# EAGLE design raspberry-alarm-clock-v2 (EAGLE 5.12)

## Sheet 1 of 7
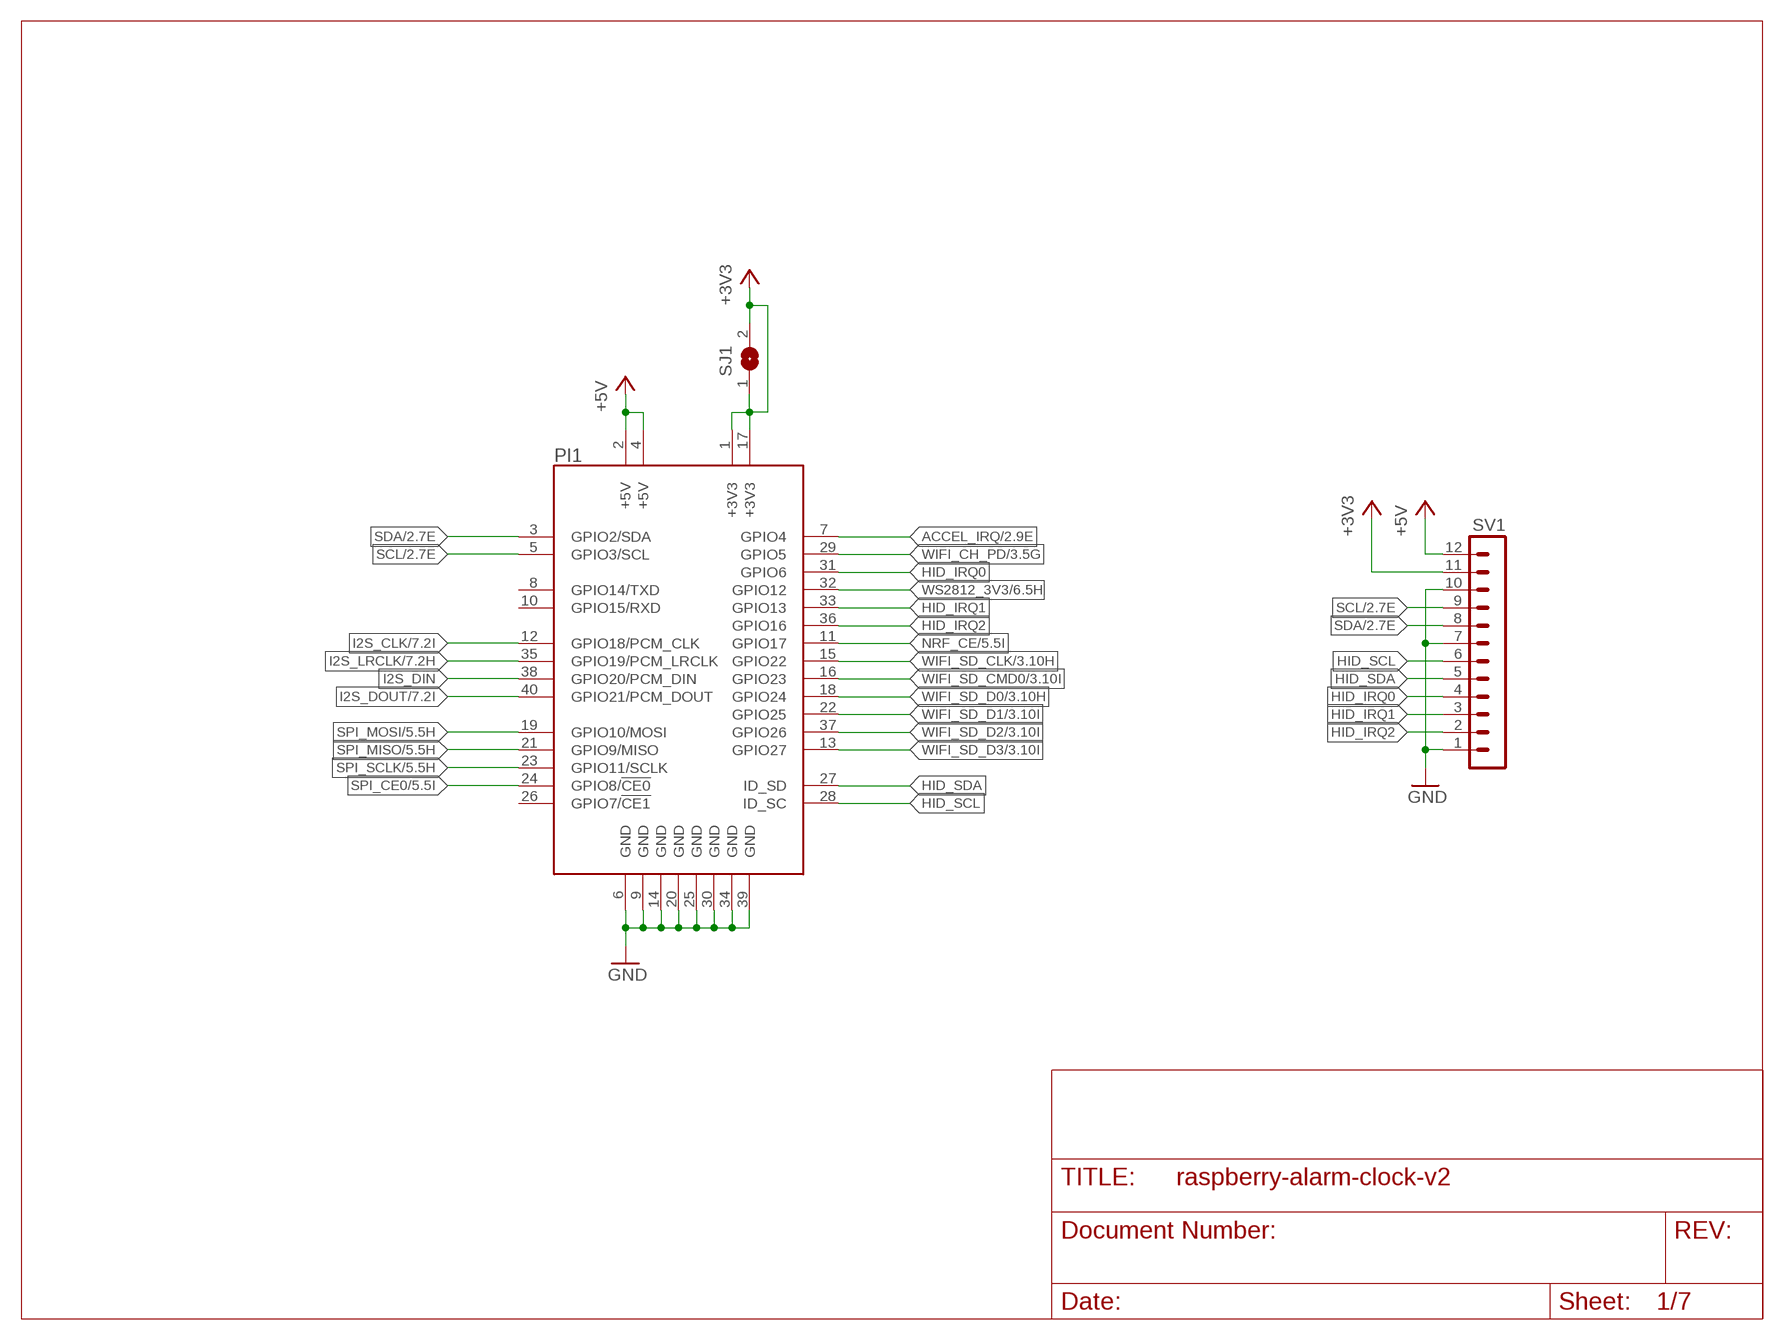
[diagram p0: schematic, sheet 1]

### Parts
PI1  PIHAT-REVERSE-COMBO  [PIHAT-REVERSE-COMBO]
SJ1  SJ  [SJ]
SV1  MA12-1W  [MA12-1W]

### Nets
+3V3: PI1.1(+3V3) PI1.17(+3V3) SJ1.1 SJ1.2 SV1.11 ; also sheet 2,3,4,5
+5V: PI1.2(+5V) PI1.4(+5V) SV1.12 ; also sheet 4,6
ACCEL_IRQ: PI1.7(GPIO4) ; also sheet 2
GND: PI1.6(GND) PI1.9(GND) PI1.14(GND) PI1.20(GND) PI1.25(GND) PI1.30(GND) PI1.34(GND) PI1.39(GND) SV1.1 SV1.7 SV1.10 ; also sheet 2,3,4,5,6,7
HID_IRQ0: PI1.31(GPIO6) SV1.4
HID_IRQ1: PI1.33(GPIO13) SV1.3
HID_IRQ2: PI1.36(GPIO16) SV1.2
HID_SCL: PI1.28(ID_SC) SV1.6
HID_SDA: PI1.27(ID_SD) SV1.5
I2S_CLK: PI1.12(GPIO18/PCM_CLK) ; also sheet 7
I2S_DIN: PI1.38(GPIO20/PCM_DIN)
I2S_DOUT: PI1.40(GPIO21/PCM_DOUT) ; also sheet 7
I2S_LRCLK: PI1.35(GPIO19/PCM_LRCLK) ; also sheet 7
NRF_CE: PI1.11(GPIO17) ; also sheet 5
SCL: PI1.5(GPIO3/SCL) SV1.9 ; also sheet 2
SDA: PI1.3(GPIO2/SDA) SV1.8 ; also sheet 2
SPI_CE0: PI1.24(GPIO8/!CE0) ; also sheet 5
SPI_MISO: PI1.21(GPIO9/MISO) ; also sheet 5
SPI_MOSI: PI1.19(GPIO10/MOSI) ; also sheet 5
SPI_SCLK: PI1.23(GPIO11/SCLK) ; also sheet 5
WIFI_CH_PD: PI1.29(GPIO5) ; also sheet 3
WIFI_SD_CLK: PI1.15(GPIO22) ; also sheet 3
WIFI_SD_CMD0: PI1.16(GPIO23) ; also sheet 3
WIFI_SD_D0: PI1.18(GPIO24) ; also sheet 3
WIFI_SD_D1: PI1.22(GPIO25) ; also sheet 3
WIFI_SD_D2: PI1.37(GPIO26) ; also sheet 3
WIFI_SD_D3: PI1.13(GPIO27) ; also sheet 3
WS2812_3V3: PI1.32(GPIO12) ; also sheet 6
Unconnected: PI1.8(GPIO14/TXD) PI1.10(GPIO15/RXD) PI1.26(GPIO7/!CE1)

## Sheet 2 of 7
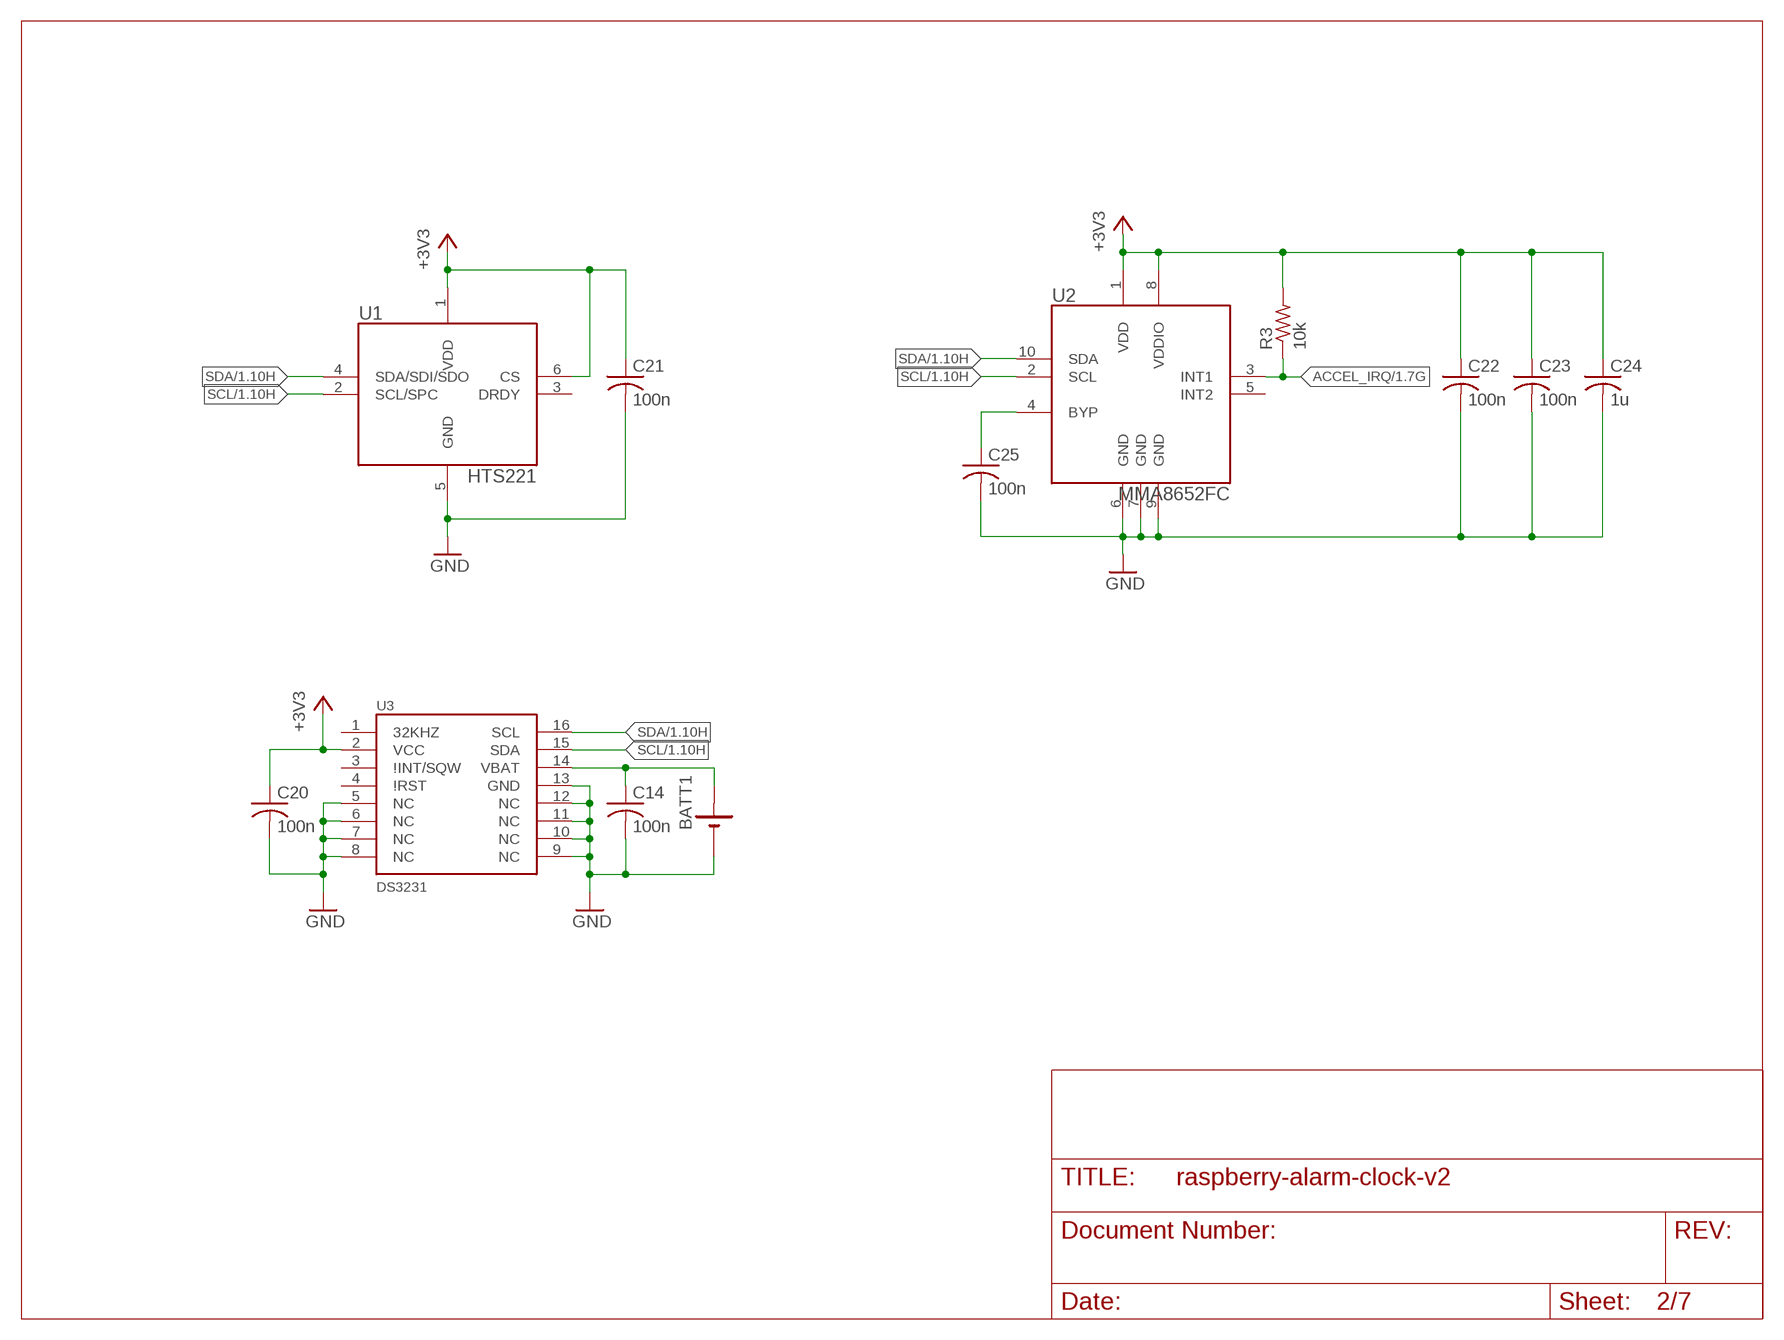
[diagram p1: schematic, sheet 2]

### Parts
BATT1  2032SMD  [2032SMD]
C14  100n  C-USC0603  [C0603]
C20  100n  C-USC0603  [C0603]
C21  100n  C-USC0603  [C0603]
C22  100n  C-USC0603  [C0603]
C23  100n  C-USC0603  [C0603]
C24  1u  C-USC0603  [C0603]
C25  100n  C-USC0603  [C0603]
R3  10k  R-US_R0603  [R0603]
U1  HTS221  [HLGA-6L]
U2  MMA8652FC  [DFN-10]
U3  DS3231  [SO16W]

### Nets
+3V3: C20.1 C21.1 C22.1 C23.1 C24.1 R3.2 U1.1(VDD) U1.6(CS) U2.1(VDD) U2.8(VDDIO) U3.2(VCC) ; also sheet 1,3,4,5
ACCEL_IRQ: R3.1 U2.3(INT1) ; also sheet 1
GND: BATT1.- C14.2 C20.2 C21.2 C22.2 C23.2 C24.2 C25.2 U1.5(GND) U2.6(GND) U2.7(GND) U2.9(GND) U3.5(NC) U3.6(NC) U3.7(NC) U3.8(NC) U3.9(NC) U3.10(NC) U3.11(NC) U3.12(NC) U3.13(GND) ; also sheet 1,3,4,5,6,7
N$16: BATT1.+ C14.1 U3.14(VBAT)
N$17: C25.1 U2.4(BYP)
SCL: U1.2(SCL/SPC) U2.2(SCL) U3.15(SDA) ; also sheet 1
SDA: U1.4(SDA/SDI/SDO) U2.10(SDA) U3.16(SCL) ; also sheet 1
Unconnected: U1.3(DRDY) U2.5(INT2) U3.1(32KHZ) U3.3(\!INT/SQW) U3.4(\!RST)

## Sheet 3 of 7
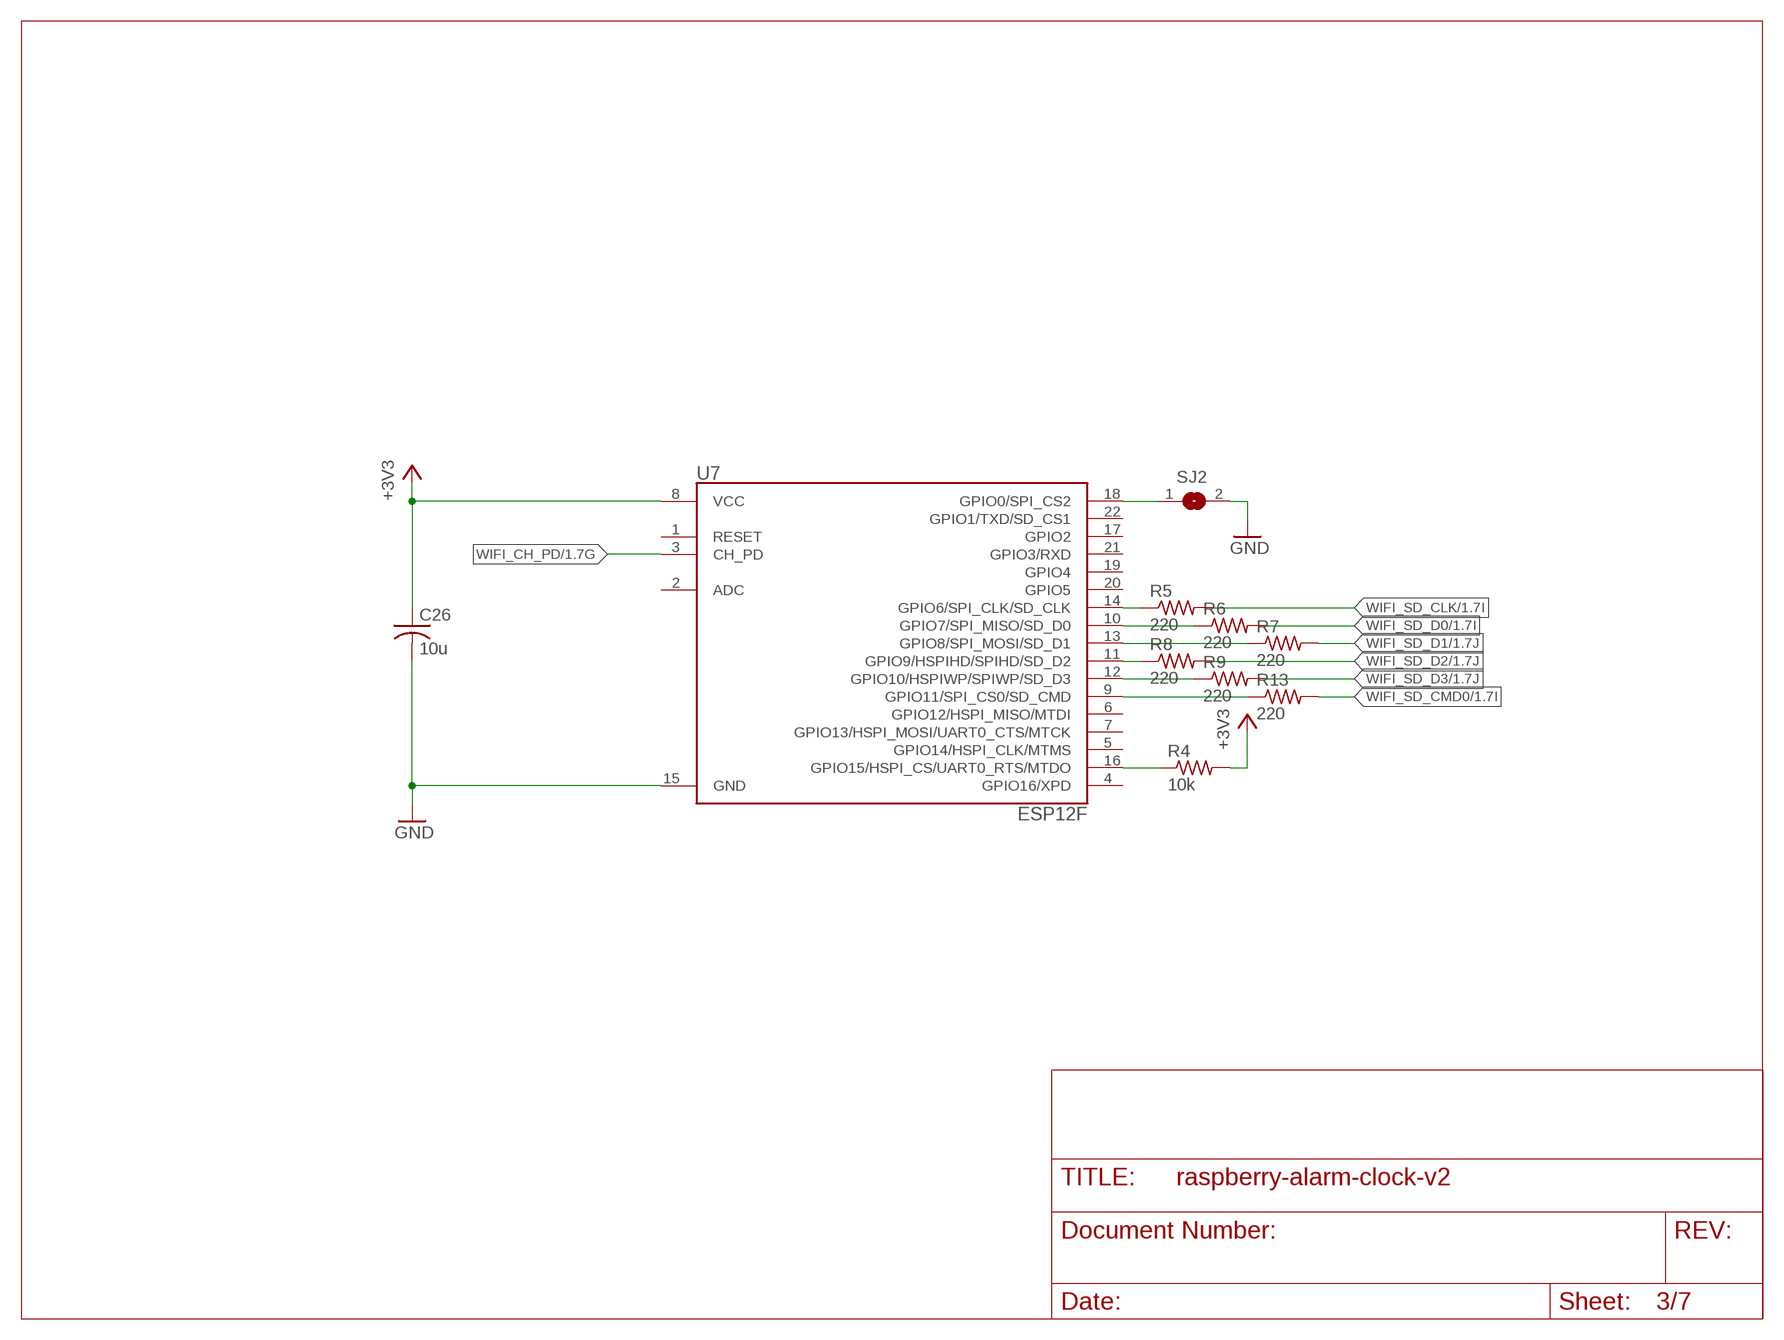
[diagram p2: schematic, sheet 3]

### Parts
C26  10u  C-USC0805  [C0805]
R4  10k  R-US_R0603  [R0603]
R5  220  R-US_R0603  [R0603]
R6  220  R-US_R0603  [R0603]
R7  220  R-US_R0603  [R0603]
R8  220  R-US_R0603  [R0603]
R9  220  R-US_R0603  [R0603]
R13  220  R-US_R0603  [R0603]
SJ2  SJ  [SJ]
U7  ESP12F  [ESP12F]

### Nets
+3V3: C26.1 R4.2 U7.8(VCC) ; also sheet 1,2,4,5
GND: C26.2 SJ2.2 U7.15(GND) ; also sheet 1,2,4,5,6,7
N$18: R6.1 U7.10(GPIO7/SPI_MISO/SD_D0)
N$19: R7.1 U7.13(GPIO8/SPI_MOSI/SD_D1)
N$20: R5.1 U7.14(GPIO6/SPI_CLK/SD_CLK)
N$21: R8.1 U7.11(GPIO9/HSPIHD/SPIHD/SD_D2)
N$22: R9.1 U7.12(GPIO10/HSPIWP/SPIWP/SD_D3)
N$23: R13.1 U7.9(GPIO11/SPI_CS0/SD_CMD)
N$24: R4.1 U7.16(GPIO15/HSPI_CS/UART0_RTS/MTDO)
N$25: SJ2.1 U7.18(GPIO0/SPI_CS2)
WIFI_CH_PD: U7.3(CH_PD) ; also sheet 1
WIFI_SD_CLK: R5.2 ; also sheet 1
WIFI_SD_CMD0: R13.2 ; also sheet 1
WIFI_SD_D0: R6.2 ; also sheet 1
WIFI_SD_D1: R7.2 ; also sheet 1
WIFI_SD_D2: R8.2 ; also sheet 1
WIFI_SD_D3: R9.2 ; also sheet 1
Unconnected: U7.1(RESET) U7.2(ADC) U7.4(GPIO16/XPD) U7.5(GPIO14/HSPI_CLK/MTMS) U7.6(GPIO12/HSPI_MISO/MTDI) U7.7(GPIO13/HSPI_MOSI/UART0_CTS/MTCK) U7.17(GPIO2) U7.19(GPIO4) U7.20(GPIO5) U7.21(GPIO3/RXD) U7.22(GPIO1/TXD/SD_CS1)

## Sheet 4 of 7
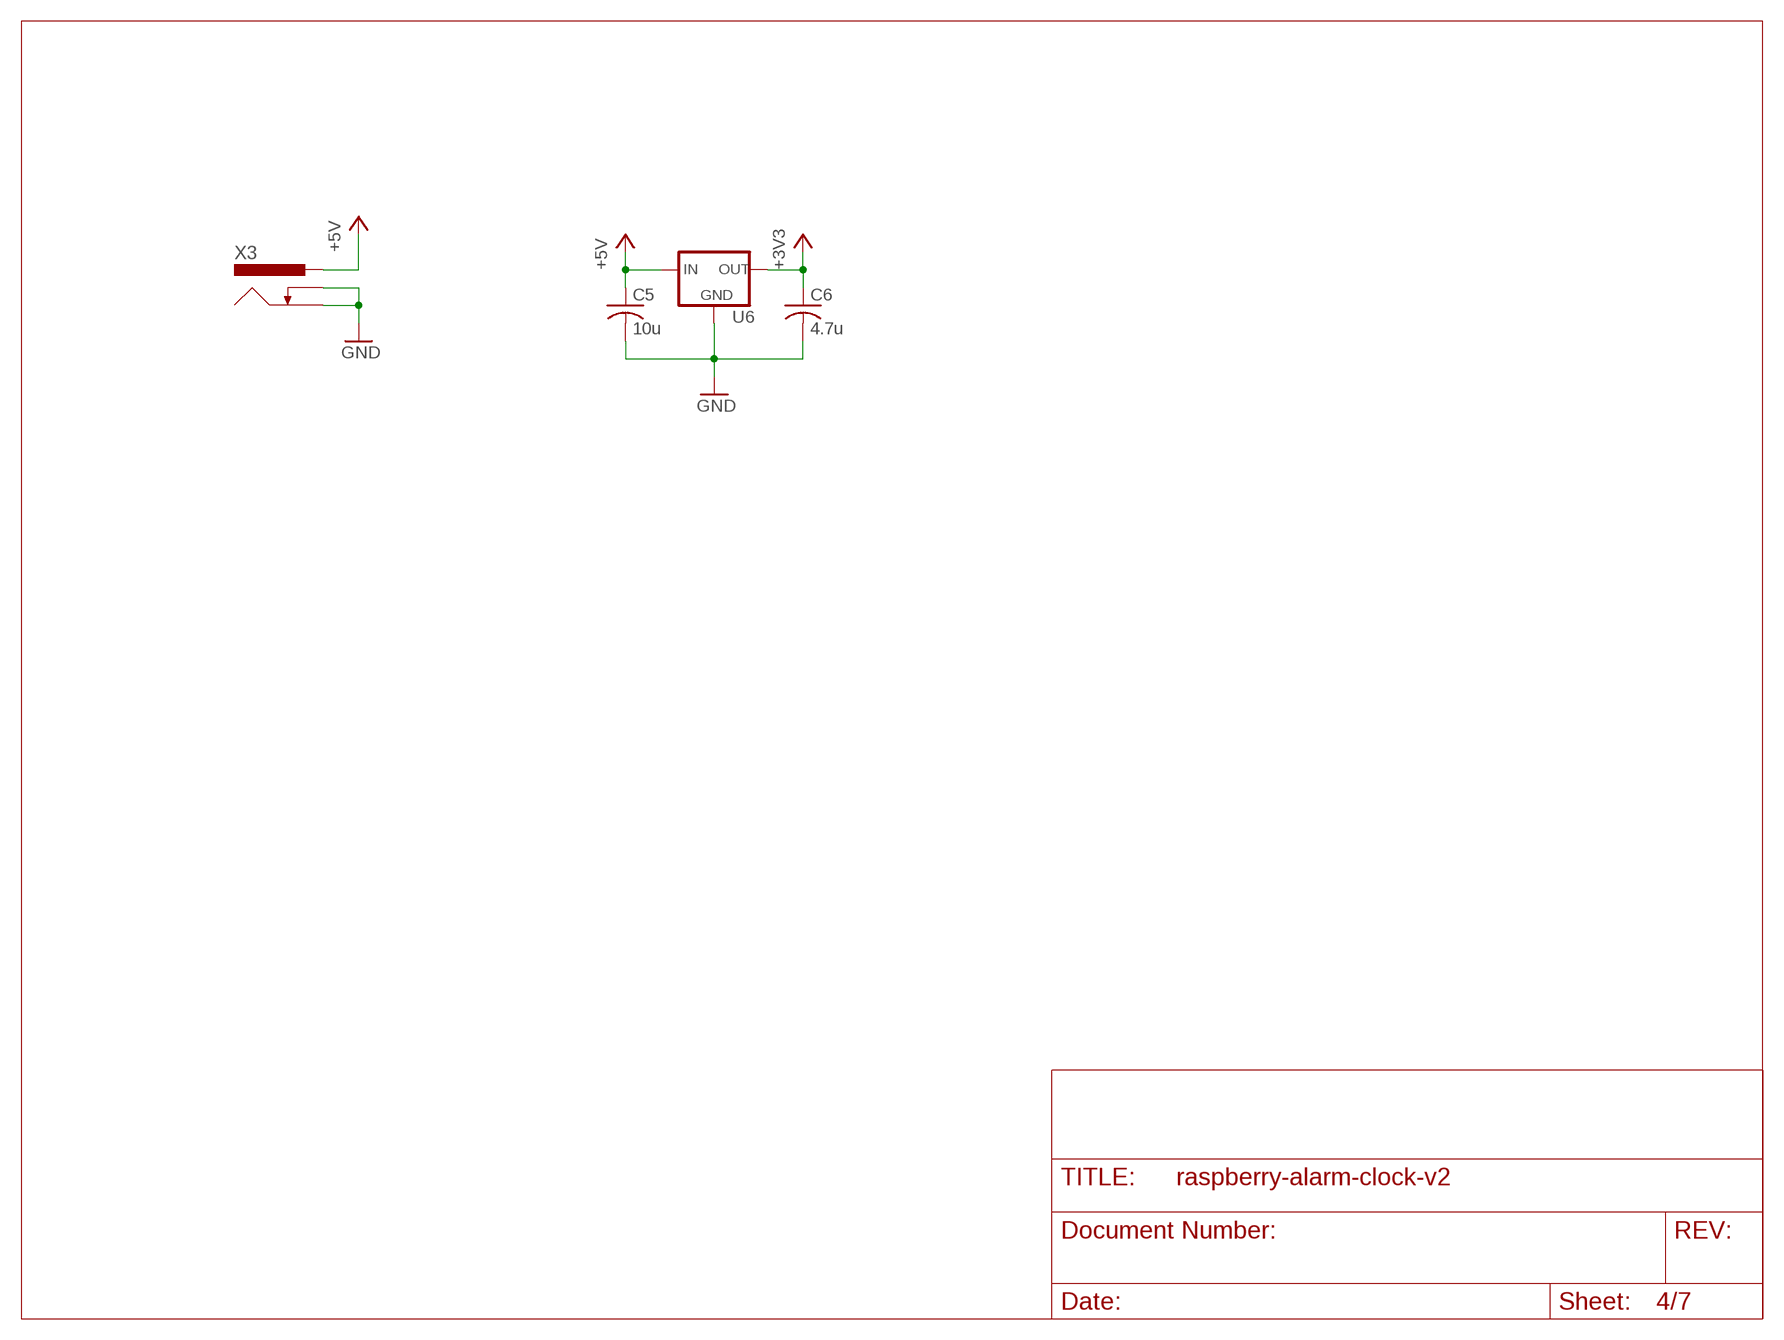
[diagram p3: schematic, sheet 4]

### Parts
C5  10u  C-USC0805  [C0805]
C6  4.7u  C-USC0805  [C0805]
U6  LM1117  [SOT223]
X3  PJ-002-SMTBH  [PJ-002-SMT]

### Nets
+3V3: C6.1 U6.2(OUT) ; also sheet 1,2,3,5
+5V: C5.1 U6.3(IN) X3.1A ; also sheet 1,6
GND: C5.2 C6.2 U6.1(GND) X3.2 X3.3 ; also sheet 1,2,3,5,6,7

## Sheet 5 of 7
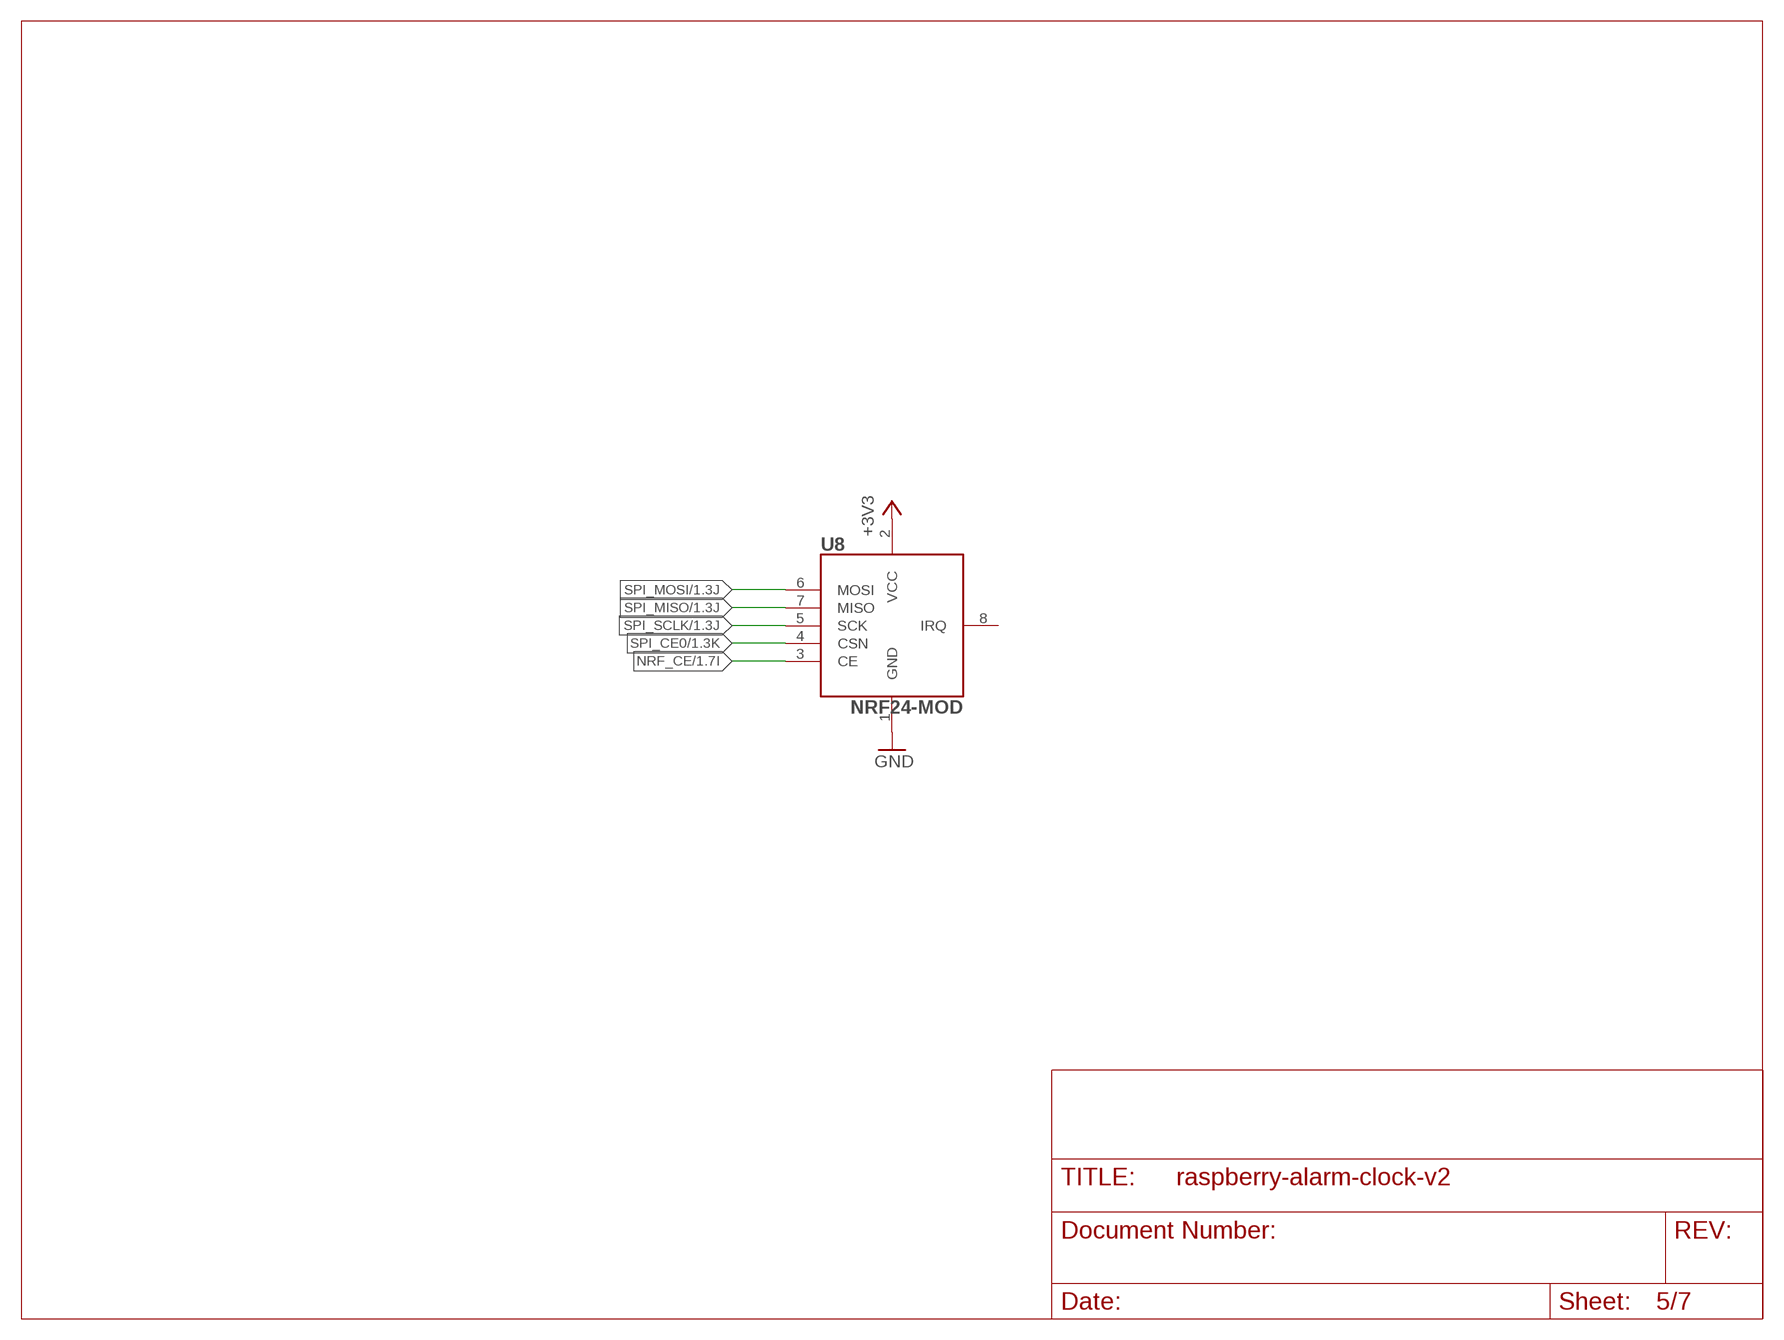
[diagram p4: schematic, sheet 5]

### Parts
U8  NRF24-MOD  [NRF24]

### Nets
+3V3: U8.2(VCC) ; also sheet 1,2,3,4
GND: U8.1(GND) ; also sheet 1,2,3,4,6,7
NRF_CE: U8.3(CE) ; also sheet 1
SPI_CE0: U8.4(CSN) ; also sheet 1
SPI_MISO: U8.7(MISO) ; also sheet 1
SPI_MOSI: U8.6(MOSI) ; also sheet 1
SPI_SCLK: U8.5(SCK) ; also sheet 1
Unconnected: U8.8(IRQ)

## Sheet 6 of 7
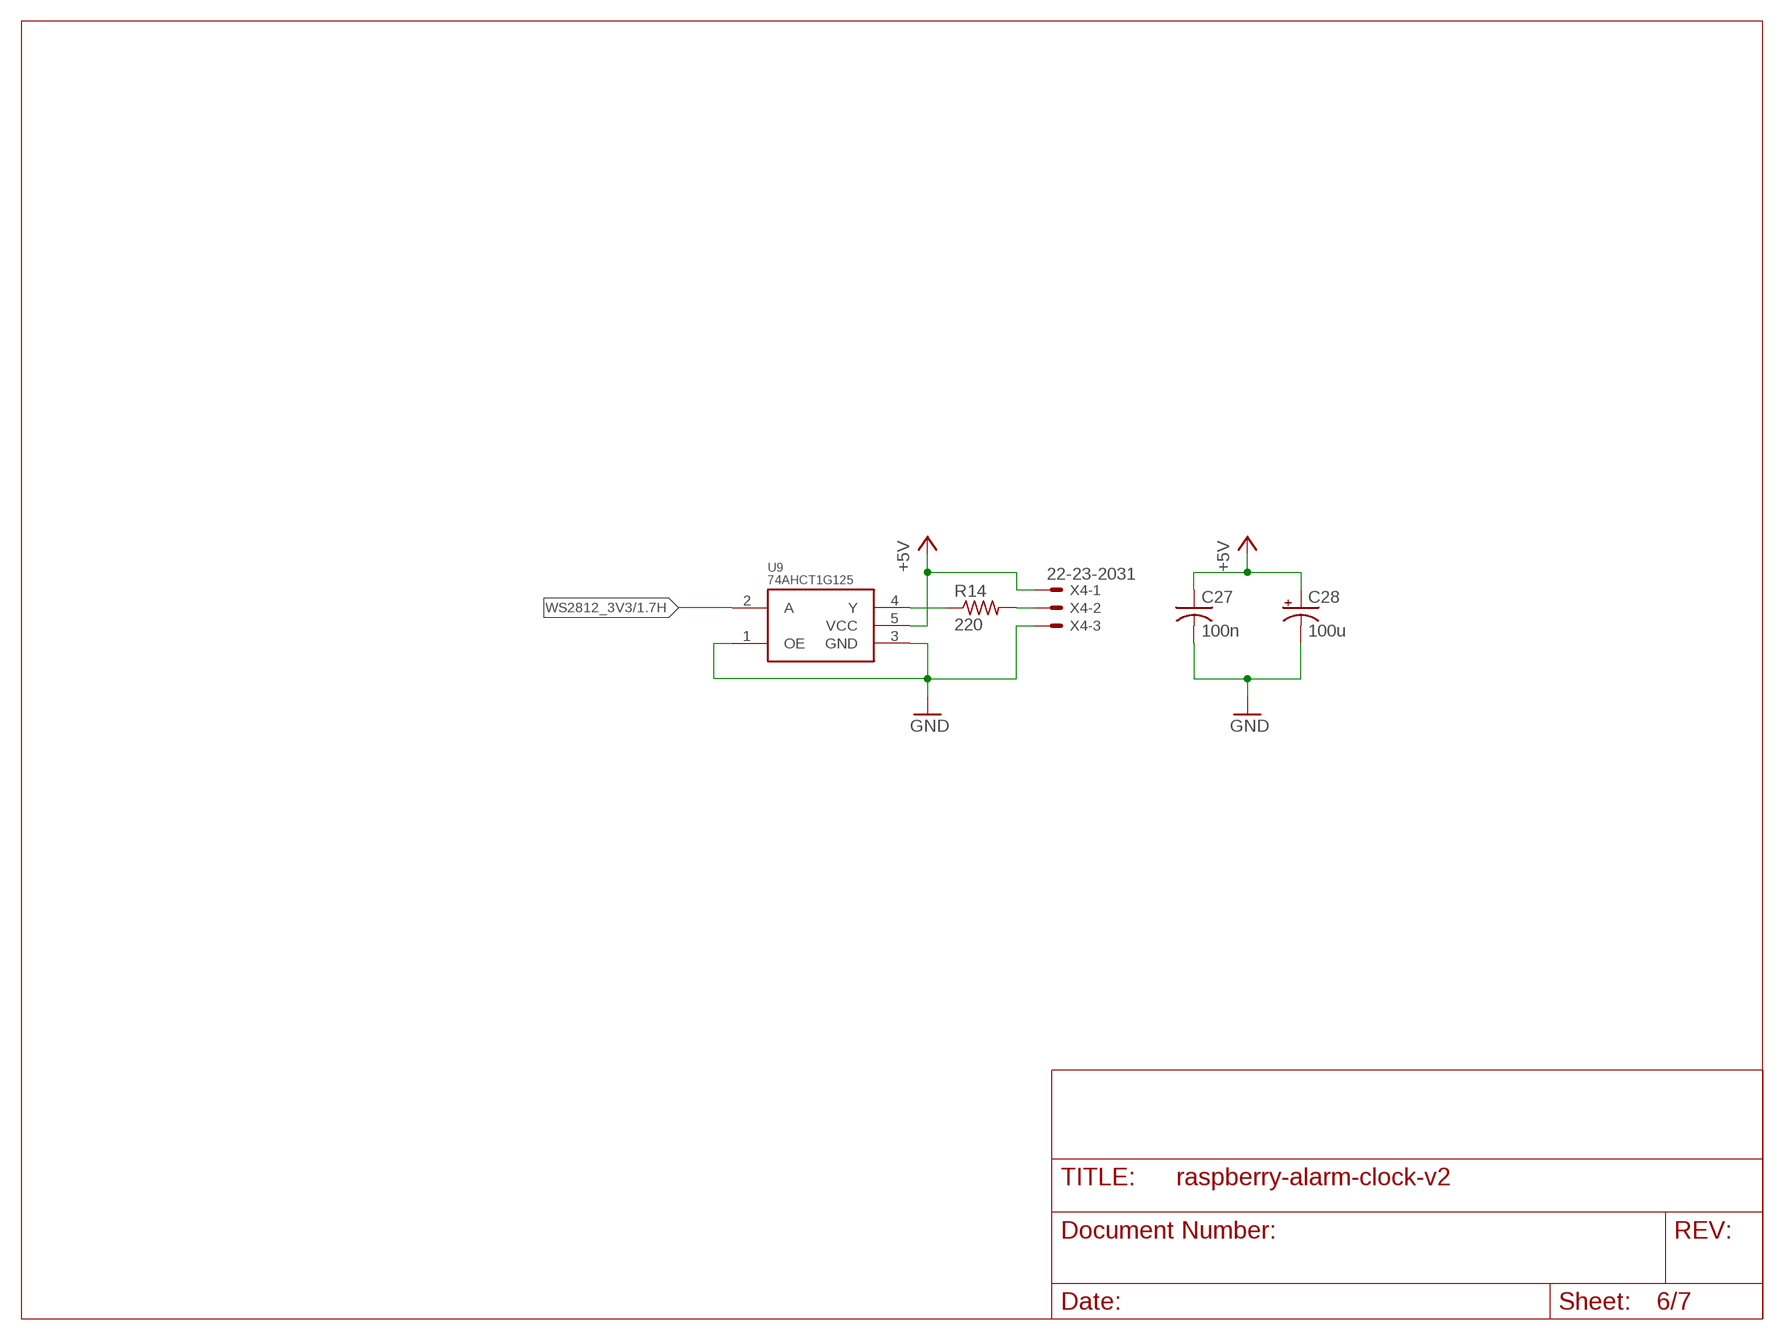
[diagram p5: schematic, sheet 6]

### Parts
C27  100n  C-USC0603  [C0603]
C28  100u  CPOL-USC  [PANASONIC_C]
R14  220  R-US_R0603  [R0603]
U9  74AHCT1G125  74LVC1G125  [SOT-23-5]
X4  22-23-2031  [22-23-2031]

### Nets
+5V: C27.1 C28.+ U9.5(VCC) X4.1 ; also sheet 1,4
GND: C27.2 C28.- U9.1(OE) U9.3(GND) X4.3 ; also sheet 1,2,3,4,5,7
N$26: R14.1 U9.4(Y)
N$27: R14.2 X4.2
WS2812_3V3: U9.2(A) ; also sheet 1

## Sheet 7 of 7
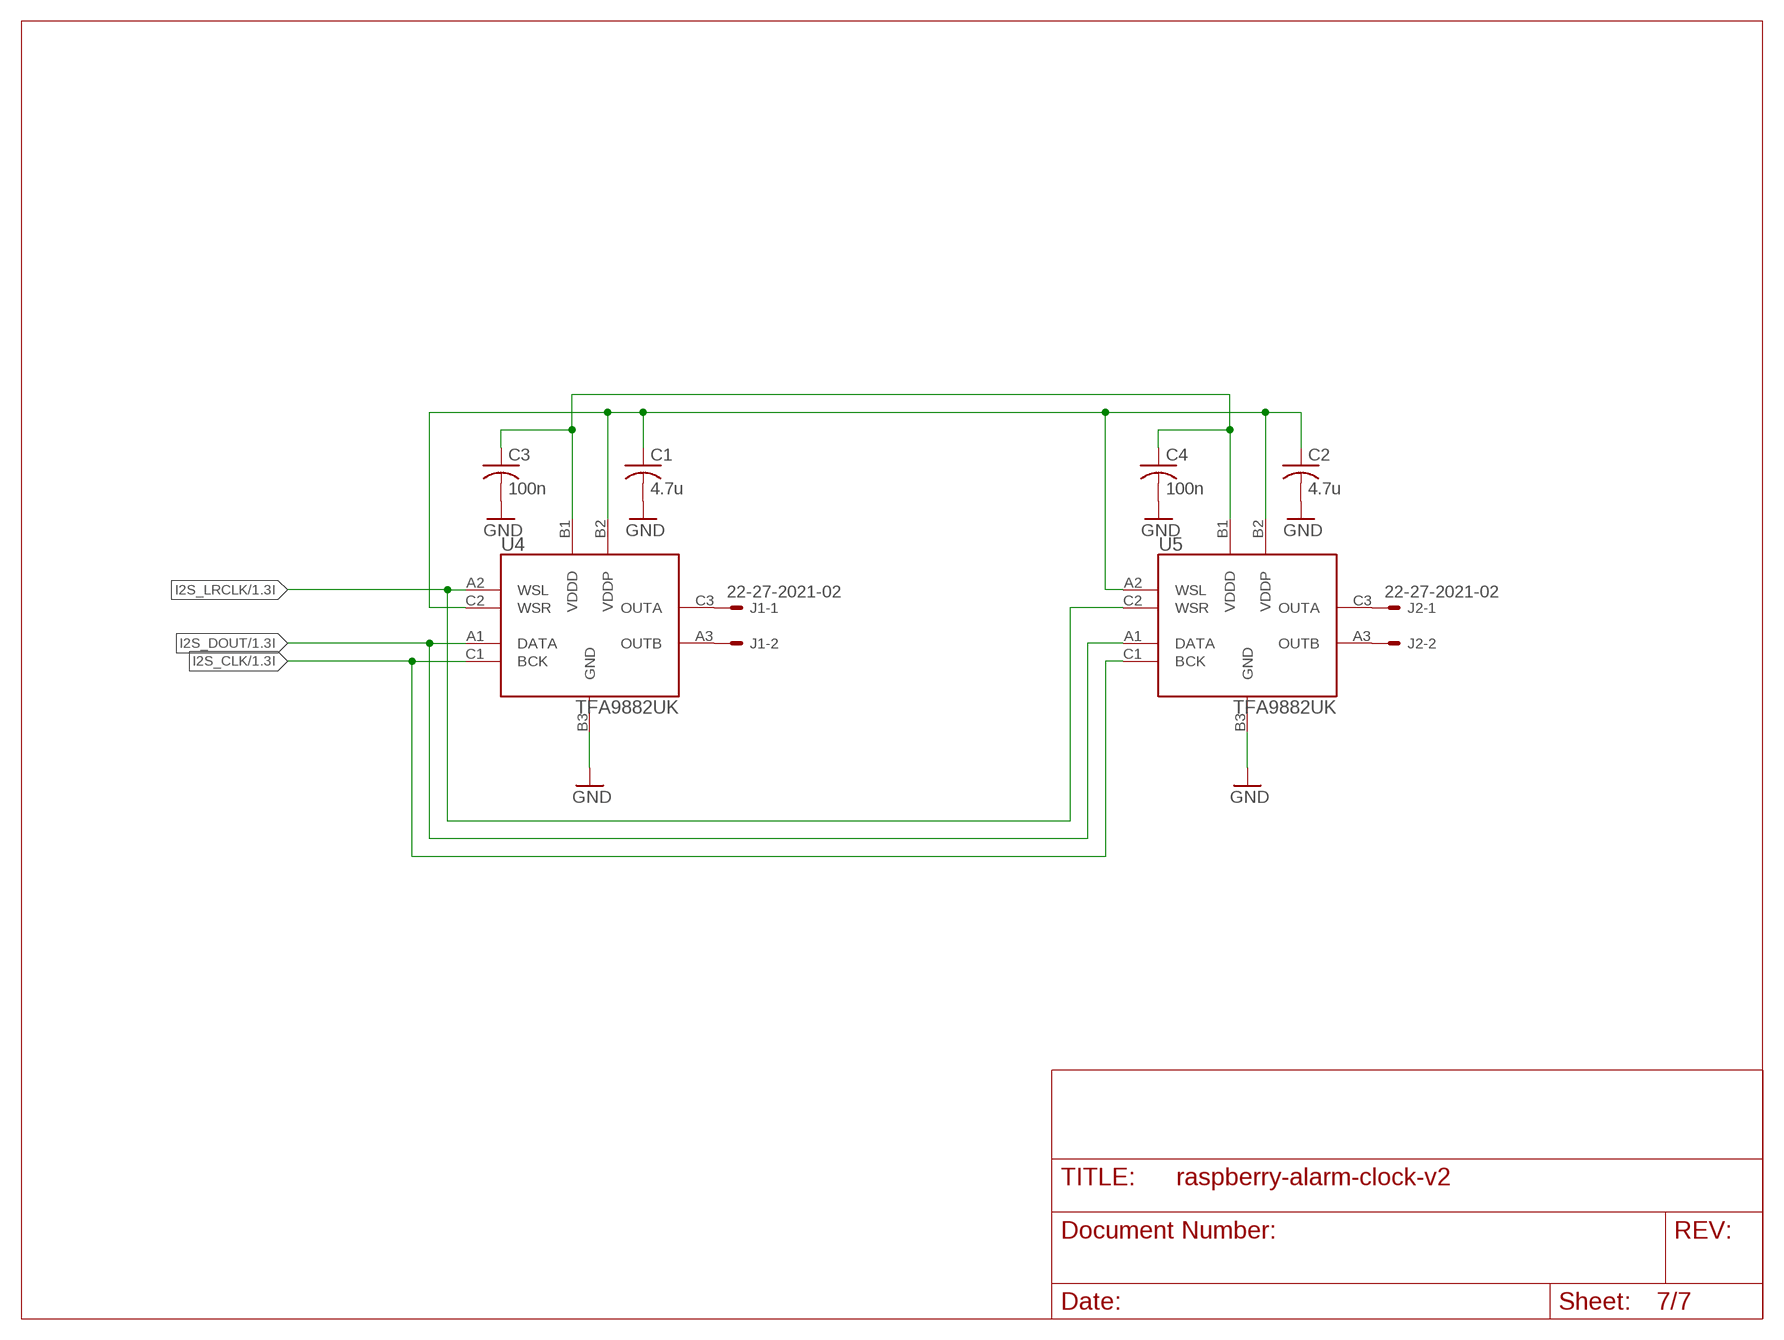
[diagram p6: schematic, sheet 7]

### Parts
C1  4.7u  C-USC0805  [C0805]
C2  4.7u  C-USC0805  [C0805]
C3  100n  C-USC0603  [C0603]
C4  100n  C-USC0603  [C0603]
J1  22-27-2021-02  [6410-02]
J2  22-27-2021-02  [6410-02]
U4  TFA9882UK  [WLCSP9]
U5  TFA9882UK  [WLCSP9]

### Nets
GND: C1.2 C2.2 C3.2 C4.2 U4.B3(GND) U5.B3(GND) ; also sheet 1,2,3,4,5,6
I2S_CLK: U4.C1(BCK) U5.C1(BCK) ; also sheet 1
I2S_DOUT: U4.A1(DATA) U5.A1(DATA) ; also sheet 1
I2S_LRCLK: U4.A2(WSL) U5.C2(WSR) ; also sheet 1
N$1: C1.1 C2.1 U4.B2(VDDP) U4.C2(WSR) U5.A2(WSL) U5.B2(VDDP)
N$2: C3.1 C4.1 U4.B1(VDDD) U5.B1(VDDD)
N$5: J1.1 U4.C3(OUTA)
N$6: J1.2 U4.A3(OUTB)
N$7: J2.1 U5.C3(OUTA)
N$8: J2.2 U5.A3(OUTB)

## Power pins joined to a net without a drawn wire
1B: X3.1B

## Library data of the parts
BATT1 = rbg-4ucon-battery:2032SMD
C1-C6 C14 C20-C27 = rcl:C-US: CAPACITOR, American symbol
C28 = rcl:CPOL-US: POLARIZED CAPACITOR, American symbol
J1 J2 = con-molex:22-?-02: CONNECTOR wire to board 2.54 mm (.1 inch) pitch header; OC_FARNELL: unknown; OC_NEWARK: unknown
PI1 = pihat:PIHAT
R3-R9 R13 R14 = rcl:R-US_: RESISTOR, American symbol
SJ1 SJ2 = jumper:SJ: SMD solder JUMPER
SV1 = con-lstb:MA12-1W: PIN HEADER; OC_FARNELL: unknown; OC_NEWARK: unknown
U1 = puck-parts:HTS221
U2 = puck-parts:MMA8652FC
U3 = DS3231:DS3231
U4 U5 = rbg-nxp-audio:TFA9882UK
U6 = v-reg-3:LM1117
U7 = rbg-expressif-esp8266b:ESP12F
U8 = rbg-nordic-nrf24:NRF24-MOD
U9 = dp_devices:74LVC1G125
X3 = rbg-cui-dcpower:PJ-002-SMT
X4 = con-molex:22-23-2031: .100" (2.54mm) Center Header - 3 Pin; MF: MOLEX; MPN: 22-23-2031; OC_FARNELL: 1462950; OC_NEWARK: 30C0862

## Board
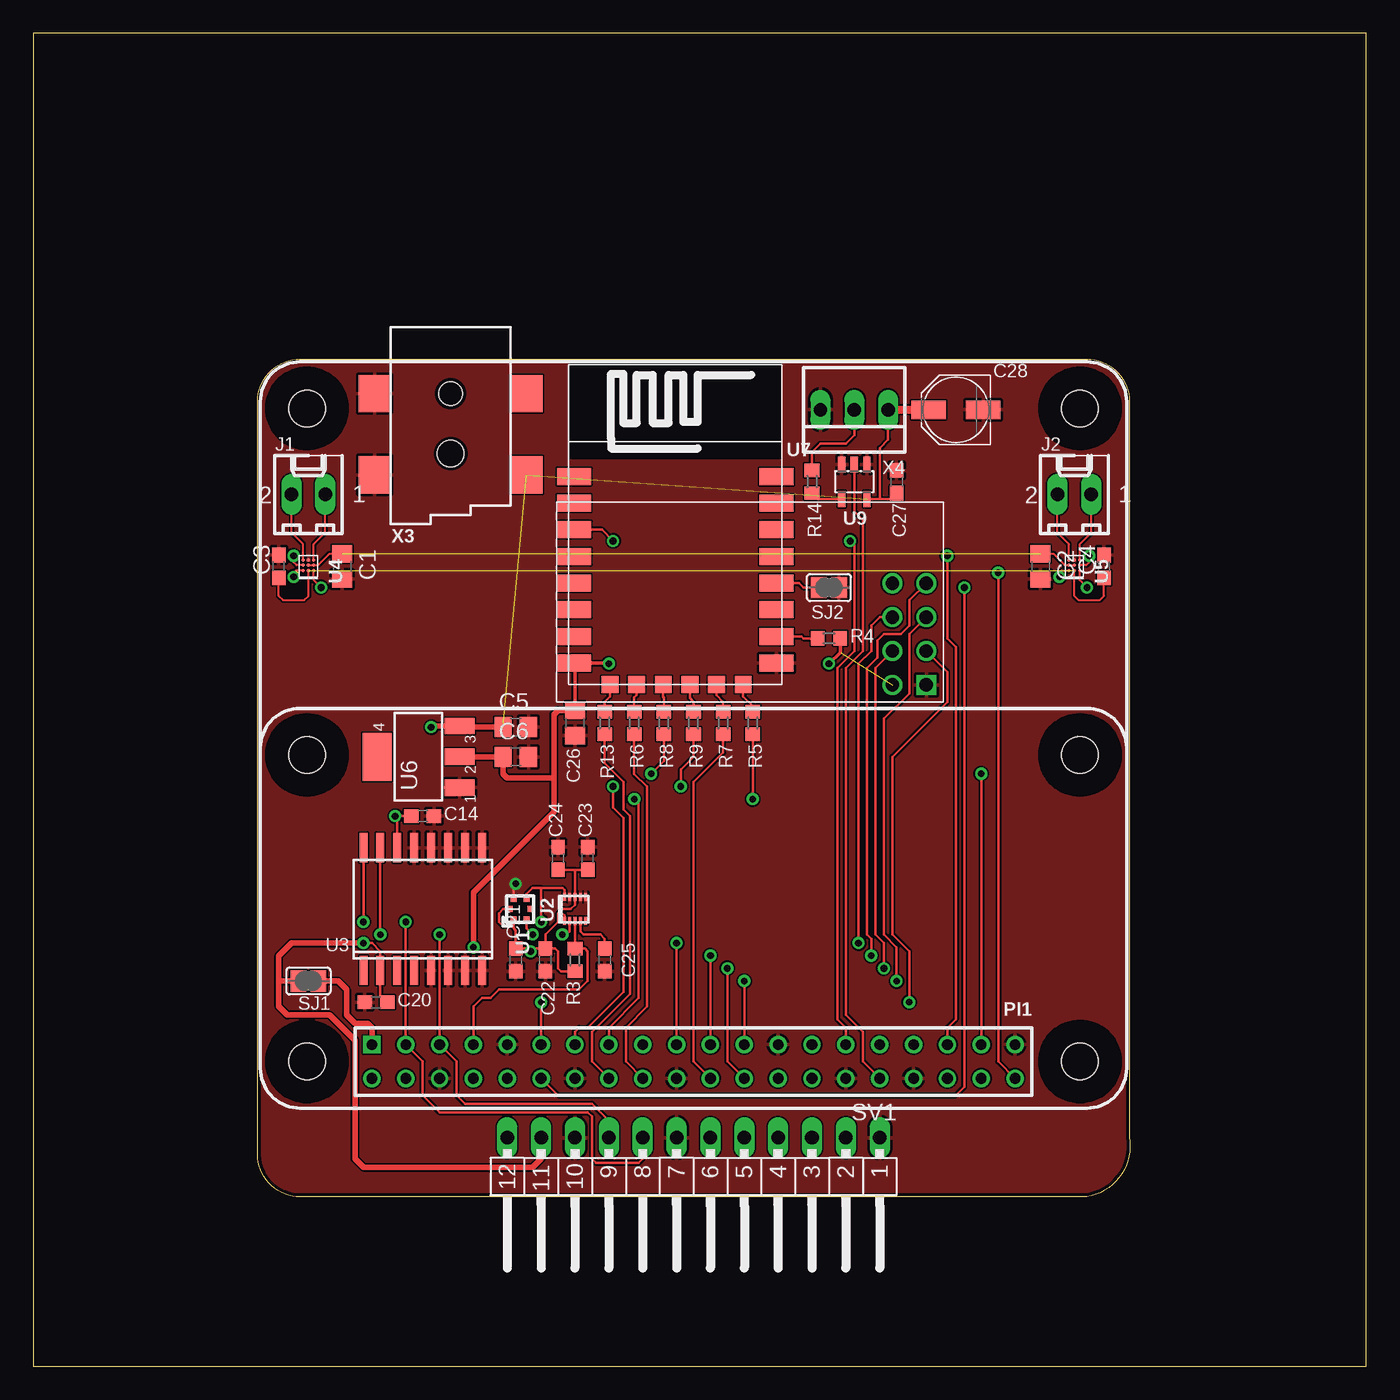
[diagram p7: board, top side]
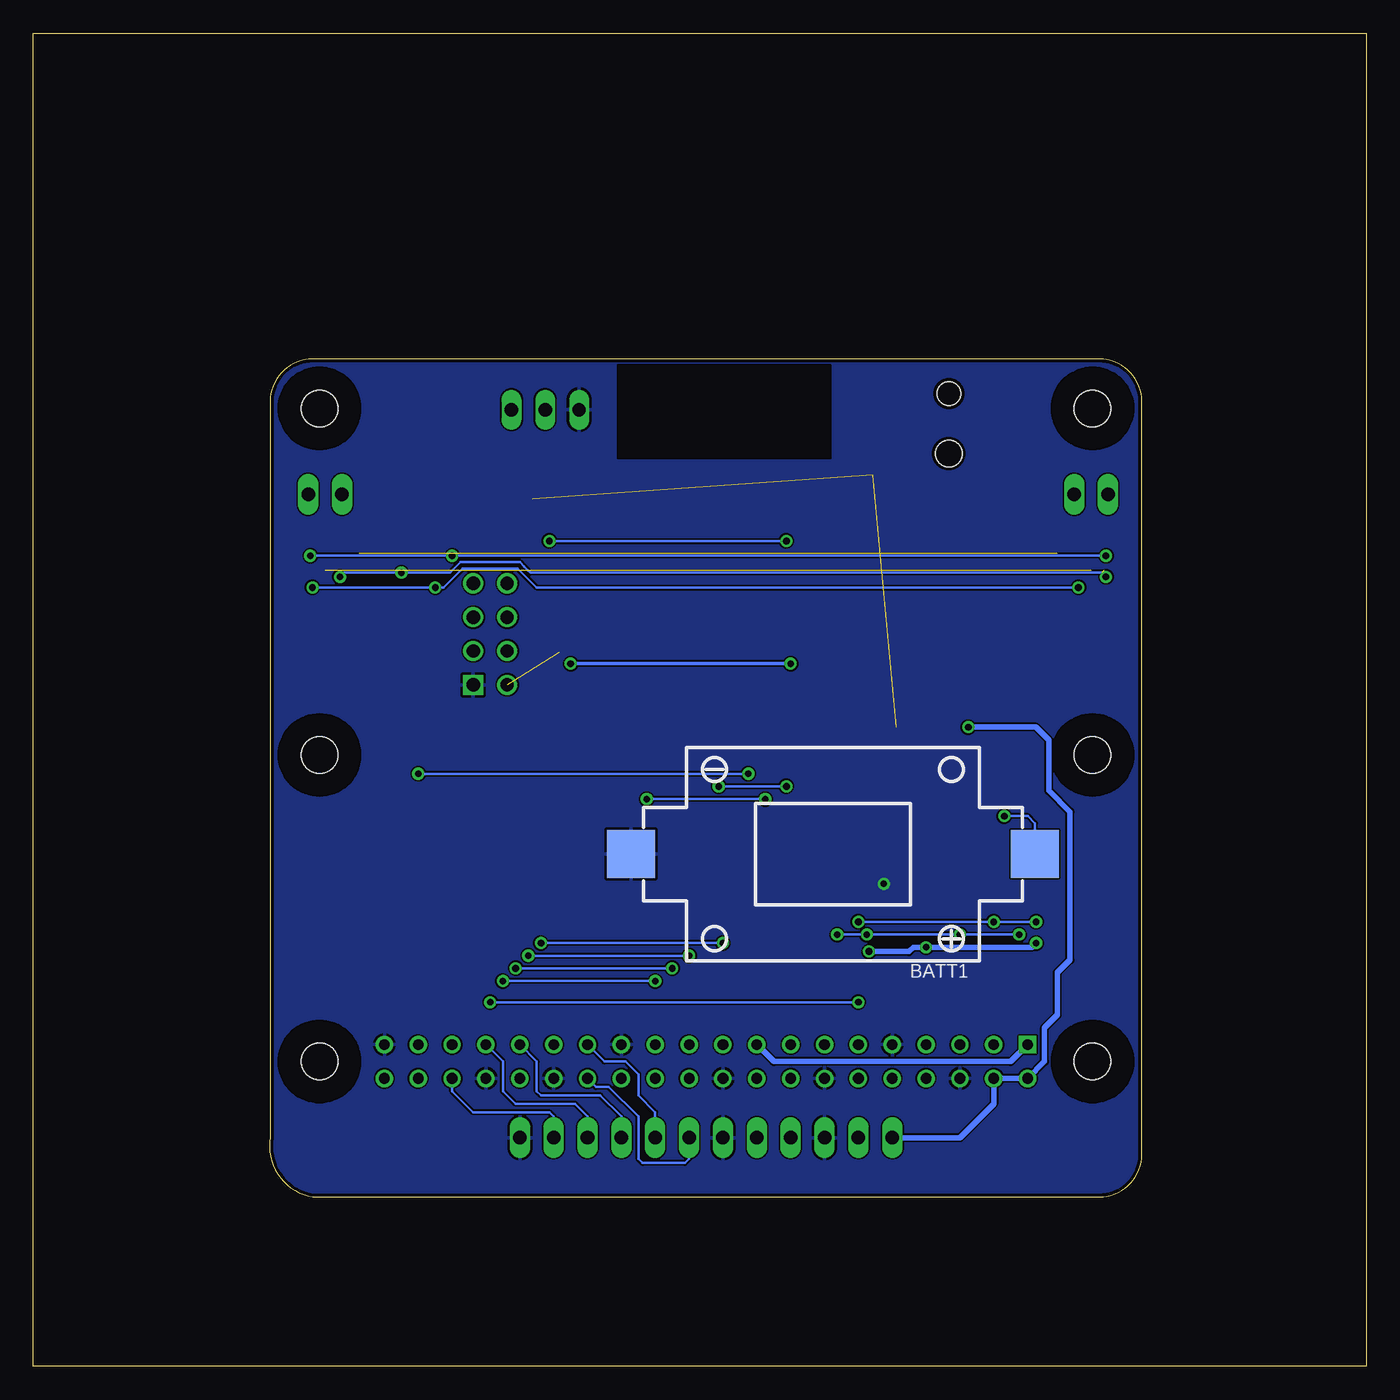
[diagram p8: board, bottom side, seen from below]

Size 100 x 100 mm. Coordinates in mm from the lower left corner, seen from the top.
Outline: 0,0 100,0 100,100 0,100 0,0
Outline: 20.03,12.7 arc-90 16.83,15.9 16.83,72.36 arc-90 20.03,75.56 79.03,75.56 arc-90 82.23,72.36 82.23,17.17 arc-90 79.03,12.7 20.03,12.7
Copper layers (1*16): Top 0.035mm / dielectric 1.5mm / Bottom 0.035mm
Design rules "default *": minimum track width 6mil, minimum drill 18mil, track to track 5mil, track to pad 5mil, pad to pad 5mil, via to via 5mil, smd to smd 5mil, copper to edge 10mil, drill to drill 8mil, minimum pad ring 10mil, minimum via ring 8mil, stop-mask expansion 4mil, vias tented up to drill 0mil, thermal gap 8mil

### Footprints (pad centres in the part's own frame; a part is rotated, then mirrored left to right if it is on the bottom)
2032SMD = smd 3.6 x 3.6: + -15.15,0; - 15.15,0
C0805 = smd 1.3 x 1.5: 1 -0.95,0; 2 0.95,0
C0603 = smd 1.1 x 1: 1 -0.85,0; 2 0.85,0
PANASONIC_C = smd 2.6 x 1.4: + 2.05,0; - -2.05,0
6410-02 = drill 1.016 long: 1 1.27,0; 2 -1.27,0
PIHAT-REVERSE-COMBO = drill 0.8 square: 1 57.15,52.07 | drill 0.8 round: 2 57.15,54.61; 3 54.61,52.07; 4 54.61,54.61; 5 52.07,52.07; 6 52.07,54.61; 7 49.53,52.07; 8 49.53,54.61; 9 46.99,52.07; 10 46.99,54.61; 11 44.45,52.07; 12 44.45,54.61; 13 41.91,52.07; 14 41.91,54.61; 15 39.37,52.07; 16 39.37,54.61; 17 36.83,52.07; 18 36.83,54.61; 19 34.29,52.07; 20 34.29,54.61; 21 31.75,52.07; 22 31.75,54.61; 23 29.21,52.07; 24 29.21,54.61; 25 26.67,52.07; 26 26.67,54.61; 27 24.13,52.07; 28 24.13,54.61; 29 21.59,52.07; 30 21.59,54.61; 31 19.05,52.07; 32 19.05,54.61; 33 16.51,52.07; 34 16.51,54.61; 35 13.97,52.07; 36 13.97,54.61; 37 11.43,52.07; 38 11.43,54.61; 39 8.89,52.07; 40 8.89,54.61 | hole 2.75: 62.02,4.34; 62.02,53.34; 4.02,4.34; 4.02,53.34; 4.02,30.34; 62.02,30.34
R0603 = smd 1 x 1.1: 1 -0.85,0; 2 0.85,0
SJ = smd 1.168 x 1.6: 1 -0.762,0; 2 0.762,0
MA12-1W = drill 1.016 long: 1 -13.97,0; 2 -11.43,0; 3 -8.89,0; 4 -6.35,0; 5 -3.81,0; 6 -1.27,0; 7 1.27,0; 8 3.81,0; 9 6.35,0; 10 8.89,0; 11 11.43,0; 12 13.97,0
HLGA-6L = smd 0.4 x 0.45: 1 -0.75,0.5; 2 -0.75,-0.5; 4 0.75,-0.5; 5 0.75,0.5 | smd 0.45 x 0.4: 3 0,-0.75; 6 0,0.75
DFN-10 = smd 0.6 x 0.225: 1 -0.9,0.8; 2 -0.9,0.4; 3 -0.9,0; 4 -0.9,-0.4; 5 -0.9,-0.8; 6 0.9,-0.8; 7 0.9,-0.4; 8 0.9,0; 9 0.9,0.4; 10 0.9,0.8
SO16W = smd 0.6 x 2.2: 1 -4.445,-4.6; 2 -3.175,-4.6; 3 -1.905,-4.6; 4 -0.635,-4.6; 5 0.635,-4.6; 6 1.905,-4.6; 7 3.175,-4.6; 8 4.445,-4.6; 9 4.445,4.6; 10 3.175,4.6; 11 1.905,4.6; 12 0.635,4.6; 13 -0.635,4.6; 14 -1.905,4.6; 15 -3.175,4.6; 16 -4.445,4.6
WLCSP9 = smd 0.26 x 0.26: A1 -0.31,0.4; A2 0.09,0.4; A3 0.49,0.4; B1 -0.31,0; B2 0.09,0; B3 0.49,0; C1 -0.31,-0.4; C2 0.09,-0.4; C3 0.49,-0.4
SOT223 = smd 1.219 x 2.235: 1 -2.311,-3.099; 2 0,-3.099; 3 2.311,-3.099 | smd 3.6 x 2.2: 4 0,3.099
ESP12F = smd 2.54 x 1.27: 1 -7.7,5.8; 2 -7.7,3.8; 3 -7.7,1.8; 4 -7.7,-0.2; 5 -7.7,-2.2; 6 -7.7,-4.2; 7 -7.7,-6.2; 8 -7.7,-8.2; 15 7.5,-8.2; 16 7.5,-6.2; 17 7.5,-4.2; 18 7.5,-2.2; 19 7.5,-0.2; 20 7.5,1.8; 21 7.5,3.8; 22 7.5,5.8 | smd 1.27 x 1.27: 9 -5,-9.8; 10 -3,-9.8; 11 -1,-9.8; 12 1,-9.8; 13 3,-9.8; 14 5,-9.8
NRF24 = drill 1 square: 1 -1.27,3.81 | drill 1 round: 2 1.27,3.81; 3 -1.27,1.27; 4 1.27,1.27; 5 -1.27,-1.27; 6 1.27,-1.27; 7 -1.27,-3.81; 8 1.27,-3.81
SOT-23-5 = smd 0.55 x 1.2: 1 -0.95,-1.3; 2 0,-1.3; 3 0.95,-1.3; 4 0.95,1.3; 5 -0.95,1.3
PJ-002-SMT = smd 2.4 x 2.8: 1A 5.7,0; 1B 5.7,6.1; 2 -5.7,6.1; 3 -5.7,0 | hole 1.8: 0,6.1 | hole 2: 0,1.6
22-23-2031 = drill 1 long: 1 -2.54,0; 2 0,0; 3 2.54,0

### Placement (x,y rotation side)
BATT1  40.01,38.42 180 bottom
C1  23.18,60.01 270 top
C2  75.56,60.01 270 top
C3  18.41,60.01 90 top
C4  80.33,60.01 90 top
C5  36.2,47.94 0 top
C6  36.2,45.72 0 top
C14  29.21,41.27 0 top
C20  25.72,27.3 180 top
C21  36.2,30.48 270 top
C22  38.42,30.48 270 top
C23  41.59,38.1 90 top
C24  39.37,38.1 90 top
C25  42.86,30.48 270 top
C26  40.64,48.26 270 top
C27  64.77,66.36 90 top
C28  69.22,71.75 180 top
J1  20.64,65.41 0 top
J2  78.11,65.41 0 top
PI1  82.55,76.2 180 top
R3  40.64,30.48 270 top
R4  59.69,54.61 0 top
R5  53.98,48.26 270 top
R6  45.09,48.26 270 top
R7  51.75,48.26 270 top
R8  47.31,48.26 270 top
R9  49.53,48.26 270 top
R13  42.86,48.26 270 top
R14  58.42,66.36 90 top
SJ1  20.64,28.89 180 top
SJ2  59.69,58.42 0 top
SV1  49.53,17.14 180 top
U1  36.51,34.29 90 top
U2  40.64,34.29 90 top
U3  29.21,34.29 0 top
U4  20.64,60.01 90 top
U5  78.11,60.01 90 top
U6  28.89,45.72 90 top
U7  48.26,60.96 0 top
U8  65.72,54.93 180 top
U9  61.59,66.36 180 top
X3  31.31,66.87 0 top
X4  61.59,71.75 180 top

### Tracks (layer width: path | path; a pad name or v marks a point on that pad's centre or on a via)
+3V3  (via drill 0.5)  (1 unrouted)
  Top 0.152: SJ1.2 SJ1.1
  Top 0.203: U1.6 35.24,34.29 34.92,33.97 34.92,33.34 35.24,33.02 35.88,33.02 36.01,32.88 | 36.01,32.88 36.2,32.7 C21.1 37.09,31.33 v37.31,31.11 | 36.01,32.88 U1.1 | C22.1 39.16,31.33 39.37,31.11 39.37,29.84 39.59,29.63 R3.2 | 40.64,37.25 C24.1 | 40.64,37.25 C23.1 | 40.64,37.25 U2.8 40.64,34.61 40.32,34.29 39.69,34.29 39.53,34.13 | 39.53,34.13 39.37,33.97 39.37,33.34 38.42,32.38 C22.1 | U2.1 39.84,33.82 39.53,34.13 | v24.77,31.75 25.4,31.75 26.04,31.11 U3.2 26.04,27.84 C20.1 | v37.31,31.11 | v37.31,31.11 37.52,31.33 C22.1
  Top 0.254: v43.18,52.7 43.12,52.76 U7.8 40.64,52.68 C26.1 | v59.69,52.7 60.54,53.55 R4.2
  Top 0.406: C26.1 39.37,49.21 39.05,48.9 39.05,44.13 | SJ1.1 22.86,28.89 23.5,28.26 23.5,26.35 24.13,25.72 25.08,25.72 25.4,25.4 PI1.1 | 39.05,44.13 39.05,41.59 33.02,35.56 v33.02,31.43 | U6.2 C6.1 35.24,44.45 35.56,44.13 39.05,44.13 | SV1.11 38.1,15.56 37.47,14.92 24.77,14.92 24.13,15.56 24.13,24.45 22.23,26.35 19.05,26.35 18.41,26.99 18.41,28.89 | 18.41,28.89 18.41,30.8 19.37,31.75 v24.77,31.75 | 18.41,28.89 SJ1.2
  Bottom 0.254: v43.18,52.7 v59.69,52.7
  Bottom 0.406: v24.77,31.75 25.08,31.43 v33.02,31.43 33.97,31.43 34.29,31.11 v37.31,31.11 | PI1.1 26.67,22.86 44.45,22.86 PI1.17
+5V  (via drill 0.5)  (2 unrouted)
  Top 0.203: U9.5 63.5,65.06 | 63.5,65.06 64.32,65.06 | X4.1 64.14,69.53 63.5,68.9 63.5,65.06
  Top 0.254: 64.32,65.06 C27.1
  Top 0.406: C5.1 32.08,47.94 U6.3 29.93,48.03 v29.84,47.94
  Top 0.61: X4.1 C28.+
  Bottom 0.406: v29.84,47.94 24.77,47.94 23.81,46.99 23.81,43.18 22.23,41.59 22.23,30.48 23.18,29.53 23.18,26.35 24.13,25.4 24.13,22.86 PI1.2 PI1.4 27.94,19.68 30.48,17.14 SV1.12
ACCEL_IRQ
  Top 0.203: U2.3 R3.1 41.38,31.33 41.59,31.11 41.59,28.89 40.96,28.26 34.92,28.26 34.29,27.62 33.66,27.62 33.02,26.99 PI1.7
GND  (via drill 0.5)
  Top 0.203: U1.5 36.01,36.01 v36.2,36.2
  pour Top: 0,100.33 100.33,100.33 100.33,0 0,0
  pour Bottom: 0,100.33 100.33,100.33 100.33,0 0,0
HID_IRQ0
  Bottom 0.203: PI1.31 62.23,22.86 62.23,20.64 61.91,20.32 57.47,20.32 55.88,18.73 SV1.4
HID_IRQ1
  Bottom 0.203: PI1.33 64.77,22.86 64.77,20.64 63.82,19.68 59.37,19.68 58.42,18.73 SV1.3
HID_IRQ2
  Bottom 0.203: PI1.36 68.58,20.64 66.99,19.05 61.28,19.05 60.96,18.73 SV1.2
HID_SCL
  Bottom 0.203: PI1.28 57.78,20.95 56.83,20.95 54.61,18.73 54.61,15.56 54.29,15.24 51.12,15.24 50.8,15.56 SV1.6
HID_SDA
  Bottom 0.203: PI1.27 57.15,22.86 55.56,22.86 54.61,21.91 54.61,20.32 53.34,19.05 SV1.5
I2S_CLK  (via drill 0.5)
  Top 0.152: U4.C1 21.04,58.97 v21.59,58.42 | v79.06,58.42 78.5,58.97 U5.C1
  Top 0.203: PI1.12 39.37,20.32 69.22,20.32 69.85,20.95 v69.85,58.42
  Bottom 0.203: v21.59,58.42 62.23,58.42 63.66,59.85 67.79,59.85 69.22,58.42 v69.85,58.42 v79.06,58.42
I2S_DOUT  (via drill 0.5)  (1 unrouted)
  Top 0.152: U4.A1 19.69,59.7 19.53,59.53 | v76.99,59.21 76.99,59.53 77.16,59.7 U5.A1
  Top 0.203: PI1.40 72.39,22.86 v72.39,59.53
  Bottom 0.203: v19.53,59.21 19.84,59.53 62.71,59.53 62.87,59.69 63.18,60.01 63.5,60.33 67.94,60.33 68.74,59.53 v72.39,59.53 76.68,59.53 76.83,59.37 v76.99,59.21
I2S_LRCLK  (via drill 0.5)
  Top 0.152: U4.A2 19.75,60.1 19.53,60.33 v19.53,60.8 | v79.22,60.8 79.22,60.33 78.99,60.1 U5.C2
  Top 0.203: v68.58,60.8 68.58,54.61 69.22,53.98 69.22,26.04 68.58,25.4 PI1.35
  Bottom 0.203: v19.53,60.8 v68.58,60.8 v79.22,60.8
N$1  (1 unrouted)
  Top 0.152: U4.B2 U4.C2 21.36,60.1 22.23,60.96 C1.1 | U5.B2 U5.A2 77.38,60.1 76.52,60.96 C2.1
N$2  (1 unrouted)
  Top 0.152: U4.B1 20.64,57.78 20.32,57.47 18.73,57.47 18.41,57.78 C3.1 | C4.1 80.33,57.78 80.01,57.47 78.42,57.47 78.11,57.78 U5.B1
N$5
  Top 0.152: U4.C3 21.04,61.68 21.91,62.55 J1.1
N$6
  Top 0.152: U4.A3 20.24,61.68 19.37,62.55 J1.2
N$7
  Top 0.152: U5.C3 78.5,61.68 79.38,62.55 J2.1
N$8
  Top 0.152: U5.A3 77.7,61.68 76.83,62.55 J2.2
N$16  (via drill 0.5)
  Top 0.203: v27.15,41.27 | v27.15,41.27 27.3,41.12 U3.14 | v27.15,41.27 C14.1
  Bottom 0.203: v27.15,41.27 25.4,41.27 24.86,40.73 BATT1.+
N$17
  Top 0.203: U2.4 41.04,32.62 41.27,32.38 42.55,32.38 42.86,32.07 C25.1
N$18
  Top 0.203: U7.10 45.26,50.34 45.09,50.16 R6.1
N$19
  Top 0.203: U7.13 51.26,50.34 51.75,49.85 R7.1
N$20
  Top 0.203: U7.14 53.26,50.24 53.98,49.53 R5.1
N$21
  Top 0.203: U7.11 47.26,50.21 47.31,50.16 R8.1
N$22
  Top 0.203: U7.12 49.26,50.12 49.53,49.85 R9.1
N$23
  Top 0.203: R13.1 42.86,49.85 43.26,50.24 U7.9
N$24
  Top 0.203: U7.16 57.63,54.76 57.78,54.61 R4.1
N$25
  Top 0.203: U7.18 57.45,58.76 57.78,58.42 SJ2.1
N$26
  Top 0.203: U9.4 58.87,65.06 R14.1
N$27
  Top 0.203: R14.2 58.42,68.58 59.05,69.22 60.96,69.22 61.59,69.85 X4.2
NRF_CE  (via drill 0.5)
  Top 0.203: U8.3 68.58,52.07 68.58,49.85 64.45,45.72 64.45,32.38 65.72,31.11 v65.72,27.3 | PI1.11 v38.1,27.3
  Bottom 0.203: v38.1,27.3 v65.72,27.3
SCL  (via drill 0.5)
  Top 0.203: v26.04,32.38 U3.15 | U2.2 40.24,32.62 40.01,32.38 v39.69,32.38 | U1.2 37.01,32.84 v37.47,32.38 | v30.48,32.38 PI1.5 31.75,22.86 31.75,20.32 32.38,19.68 41.91,19.68 43.18,18.41 SV1.9
  Bottom 0.203: v26.04,32.38 v30.48,32.38 v37.47,32.38 v39.69,32.38
SDA  (via drill 0.5)
  Top 0.203: v24.77,33.34 U3.16 | v38.1,33.34 38.1,35.88 | 38.1,35.88 37.47,35.88 37.01,35.42 U1.4 | U2.10 39.84,35.73 39.69,35.88 38.1,35.88 | v27.94,33.34 PI1.3 29.21,22.86 29.21,20.32 30.48,19.05 41.59,19.05 41.91,18.73 41.91,15.56 42.23,15.24 45.4,15.24 45.72,15.56 SV1.8
  Bottom 0.203: v24.77,33.34 v27.94,33.34 v38.1,33.34
SPI_CE0  (via drill 0.5)
  Top 0.203: U8.4 63.18,52.39 63.18,32.38 63.82,31.75 v63.82,29.84 | v52.07,29.84 52.07,22.86 PI1.24
  Bottom 0.203: v52.07,29.84 v63.82,29.84
SPI_MISO  (via drill 0.5)
  Top 0.203: PI1.21 v50.8,30.8 | U8.7 65.72,57.47 65.72,55.56 65.09,54.93 63.82,54.93 63.34,54.45 63.34,53.18 62.55,52.39 62.55,32.38 62.87,32.07 v62.87,30.8
  Bottom 0.203: v50.8,30.8 v62.87,30.8
SPI_MOSI  (via drill 0.5)
  Top 0.203: U8.6 63.5,56.2 62.87,55.56 62.87,53.66 61.91,52.7 v61.91,31.75 | PI1.19 v48.26,31.75
  Bottom 0.203: v48.26,31.75 v61.91,31.75
SPI_SCLK  (via drill 0.5)
  Top 0.203: U8.5 65.72,54.93 65.72,50.48 63.82,48.58 63.82,32.38 64.77,31.43 v64.77,28.89 | PI1.23 v53.34,28.89
  Bottom 0.203: v53.34,28.89 v64.77,28.89
WIFI_CH_PD  (via drill 0.5)
  Top 0.203: PI1.29 60.96,25.4 60.33,26.04 60.33,52.39 61.59,53.66 61.59,61.59 v61.28,61.91 | v43.5,61.91 42.65,62.76 U7.3
  Bottom 0.203: v61.28,61.91 v43.5,61.91
WIFI_SD_CLK  (via drill 0.5)
  Top 0.203: v53.98,42.55 R5.2 | v45.09,42.55 45.4,42.23 45.4,27.62 43.18,25.4 PI1.15
  Bottom 0.203: v45.09,42.55 v53.98,42.55
WIFI_SD_CMD0
  Top 0.203: PI1.16 41.91,22.86 41.91,25.08 44.77,27.94 44.77,41.27 44.29,41.75 44.29,43.81 42.86,45.24 R13.2
WIFI_SD_D0
  Top 0.203: PI1.18 44.45,22.86 44.45,25.4 46.04,26.99 46.04,43.5 45.09,44.45 R6.2
WIFI_SD_D1
  Top 0.203: PI1.22 49.53,22.86 49.53,43.81 51.75,46.04 R7.2
WIFI_SD_D2  (via drill 0.5)
  Top 0.203: R8.2 47.31,45.4 v46.35,44.45 | v71.12,44.45 PI1.37
  Bottom 0.203: v46.35,44.45 v71.12,44.45
WIFI_SD_D3  (via drill 0.5)
  Top 0.203: v48.58,43.5 48.58,44.77 49.53,45.72 R9.2 | v43.5,43.5 43.5,41.91 44.29,41.12 44.29,28.1 41.59,25.4 40.96,25.4 40.64,25.08 PI1.13
  Bottom 0.203: v43.5,43.5 v48.58,43.5
WS2812_3V3
  Top 0.203: PI1.32 62.23,22.86 62.23,25.08 60.96,26.35 60.96,52.39 62.23,53.66 62.23,63.5 61.59,64.14 U9.2